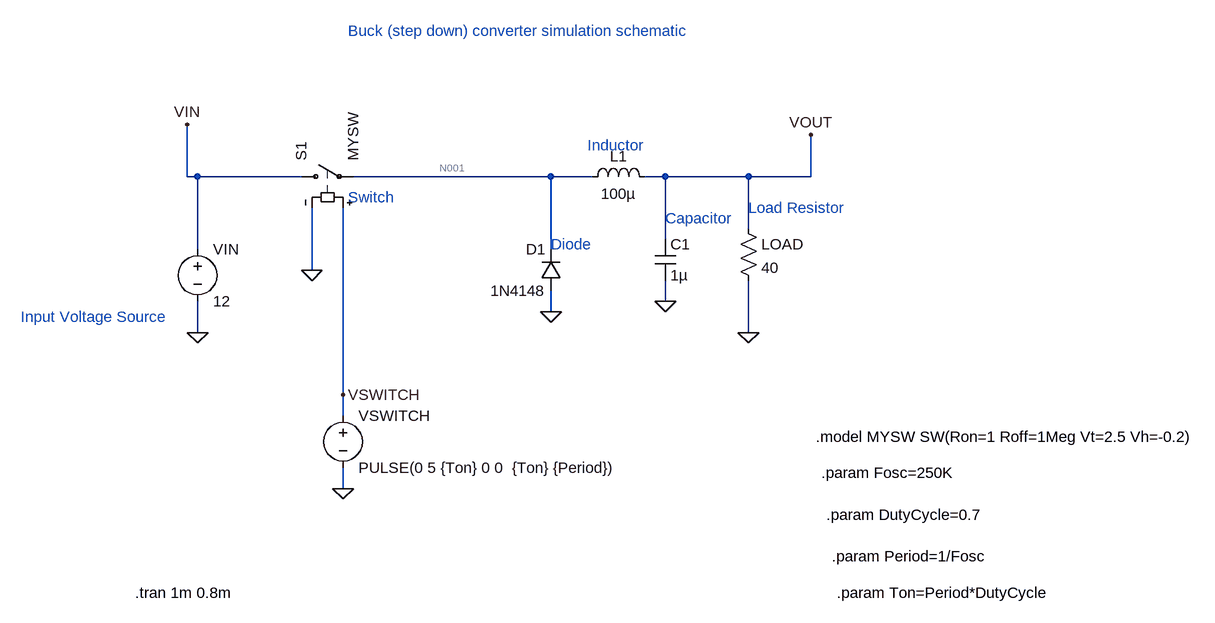
[diagram p0: schematic Draft7.asc]
Draft7.asc, the LTspice schematic file:
Version 4
SHEET 1 1632 768
WIRE 32 112 32 32
WIRE 48 112 32 112
WIRE 208 112 48 112
WIRE 592 112 288 112
WIRE 656 112 592 112
WIRE 768 112 736 112
WIRE 896 112 768 112
WIRE 992 112 992 48
WIRE 992 112 896 112
WIRE 896 192 896 112
WIRE 768 208 768 112
WIRE 48 224 48 112
WIRE 592 224 592 112
WIRE 224 256 224 160
WIRE 768 304 768 272
WIRE 592 320 592 288
WIRE 48 352 48 304
WIRE 896 352 896 272
WIRE 272 448 272 160
WIRE 272 480 272 448
WIRE 272 592 272 560
FLAG 48 352 0
FLAG 224 256 0
FLAG 272 592 0
FLAG 592 320 0
FLAG 768 304 0
FLAG 896 352 0
FLAG 32 32 VIN
FLAG 272 448 VSWITCH
FLAG 992 48 VOUT
SYMBOL voltage 48 208 R0
WINDOW 123 0 0 Left 0
WINDOW 39 0 0 Left 0
SYMATTR InstName VIN
SYMATTR Value 12
SYMBOL sw 192 112 R270
SYMATTR InstName S1
SYMATTR Value MYSW
SYMBOL voltage 272 464 R0
WINDOW 123 0 0 Left 0
WINDOW 39 0 0 Left 0
SYMATTR InstName VSWITCH
SYMATTR Value PULSE(0 5 {Ton} 0 0  {Ton} {Period})
SYMBOL ind 640 128 R270
WINDOW 0 32 56 VTop 2
WINDOW 3 5 56 VBottom 2
SYMATTR InstName L1
SYMATTR Value 100µ
SYMBOL diode 608 288 R180
WINDOW 0 24 64 Left 2
WINDOW 3 24 0 Left 2
SYMATTR InstName D1
SYMATTR Value 1N4148
SYMBOL cap 752 208 R0
SYMATTR InstName C1
SYMATTR Value 1µ
SYMBOL res 880 176 R0
SYMATTR InstName LOAD
SYMATTR Value 40
TEXT 280 -112 Left 2 ;Buck (step down) converter simulation schematic
TEXT 1000 512 Left 2 !.model MYSW SW(Ron=1 Roff=1Meg Vt=2.5 Vh=-0.2)
TEXT 1008 568 Left 2 !.param Fosc=250K
TEXT 1016 632 Left 2 !.param DutyCycle=0.7
TEXT 1024 696 Left 2 !.param Period=1/Fosc
TEXT 1032 752 Left 2 !.param Ton=Period*DutyCycle
TEXT -48 752 Left 2 !.tran 1m 0.8m
TEXT 280 144 Left 2 ;Switch
TEXT -224 328 Left 2 ;Input Voltage Source
TEXT 592 216 Left 2 ;Diode
TEXT 648 64 Left 2 ;Inductor
TEXT 896 160 Left 2 ;Load Resistor
TEXT 768 176 Left 2 ;Capacitor

The netlist it stands for:
* Draft7.asc
VIN VIN 0 12
S1 VIN N001 VSWITCH 0 MYSW
VSWITCH VSWITCH 0 PULSE(0 5 {Ton} 0 0  {Ton} {Period})
L1 N001 VOUT 100µ
D1 0 N001 1N4148
C1 VOUT 0 1µ
R§LOAD VOUT 0 40
.model D D
.lib standard.dio
* Buck (step down) converter simulation schematic
.model MYSW SW(Ron=1 Roff=1Meg Vt=2.5 Vh=-0.2)
.param Fosc=250K
.param DutyCycle=0.7
.param Period=1/Fosc
.param Ton=Period*DutyCycle
.tran 1m 0.8m
* Switch
* Input Voltage Source
* Diode
* Inductor
* Load Resistor
* Capacitor
.backanno
.end

* Results of the author's LTspice run, read from the files saved beside the schematic
* Operating Point, zero values left out:
*   V(vin) = 12 V
*   V(n001) = 480 µV
*   V(vout) = 480 µV
*   I(D1) = -26.55 pA
*   I(L1) = 12 µA
*   I(Load) = 12 µA
*   I(S1) = -12 µA
*   I(Vin) = -12 µA
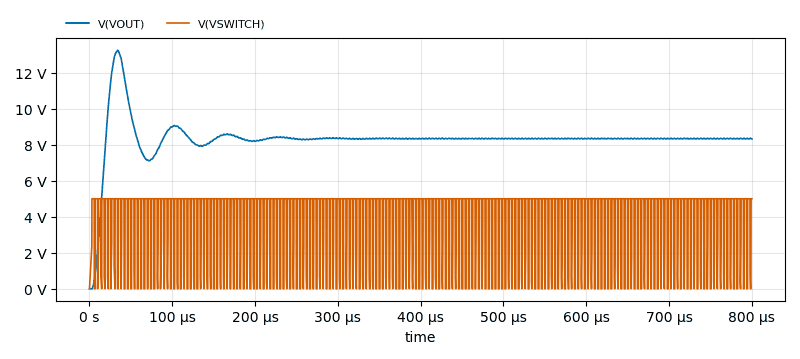
[diagram p1: Transient Analysis of Draft7.asc, plotted from the saved traces]
* Transient Analysis, 1 run:
*   V(VOUT): min 480 µV, max 13.24 V, average 8.315 V, rms 8.401 V, last 8.317 V
*   V(VSWITCH): min 0 V, max 5 V, average 3.639 V, rms 4.238 V, last 5 V